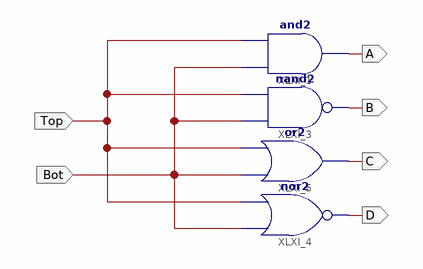
[diagram p0: schematic sheet 1]
// Xilinx ISE schematic lab1.sch (spartan3e) as structural Verilog: 4 symbols, 6 ports
module lab1 (
  input  Bot,
  input  Top,
  output A,
  output B,
  output C,
  output D
);

  and XLXI_1 (A, Bot, Top);
  nand XLXI_3 (B, Bot, Top);
  nor XLXI_4 (D, Bot, Top);
  or XLXI_5 (C, Bot, Top);
endmodule
